# Altium schematic sheet Top Level.SchDoc
size A3; SheetNumber: 1; SheetTotal: 9
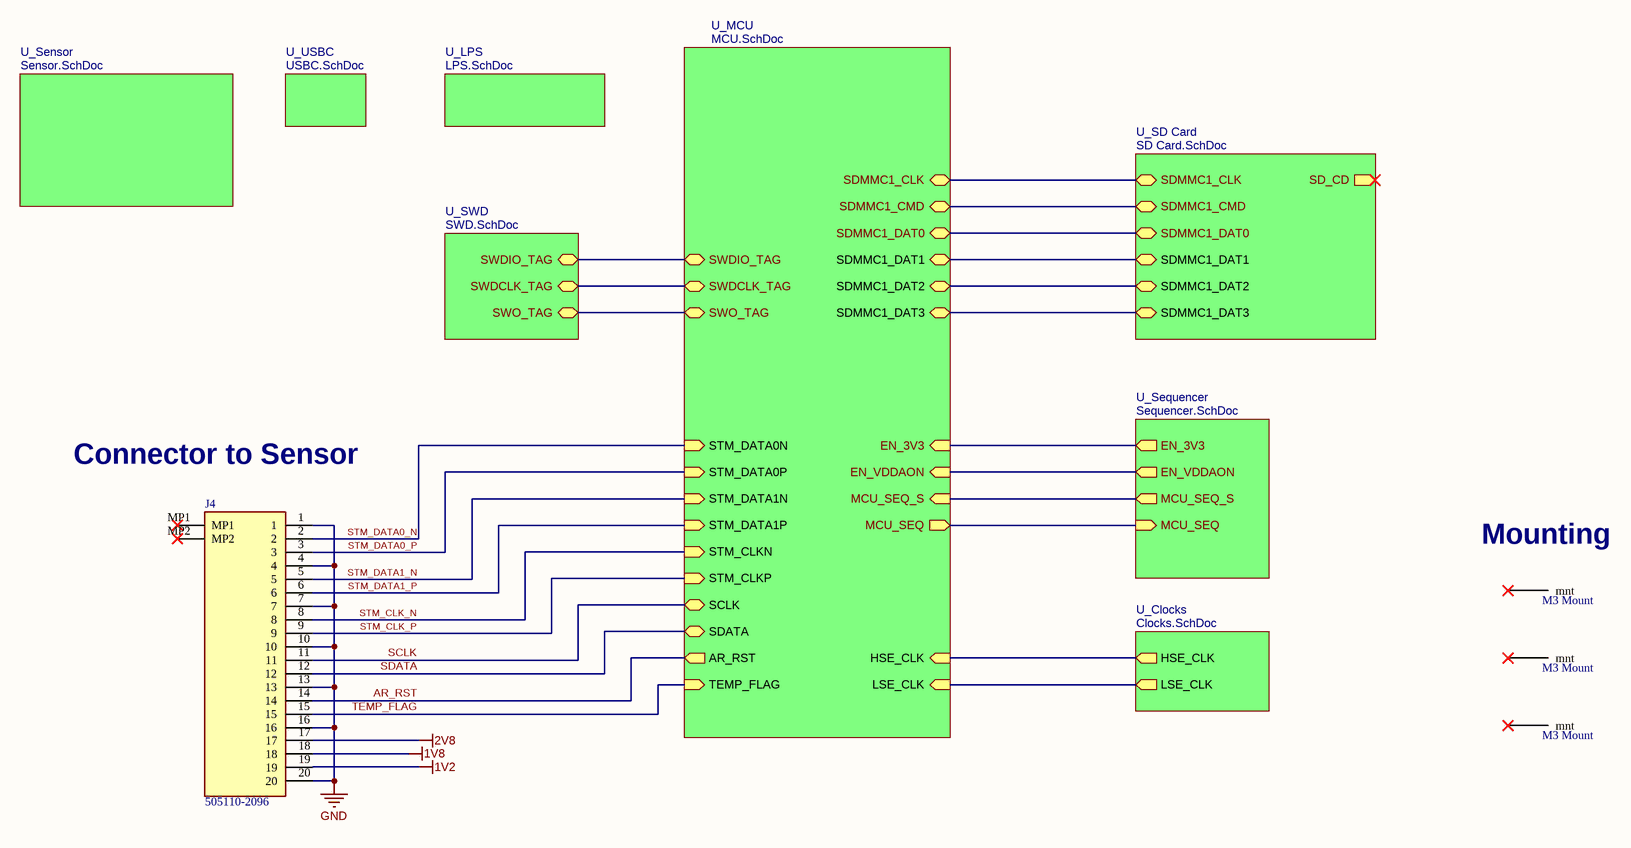
[diagram p0: Top Level.SchDoc]

## Parts
J4  505110-2096  [5051102096]
MNT1  M3 Mount  [M3_Mount-Footprint-1]
MNT2  M3 Mount  [M3_Mount-Footprint-1]
MNT3  M3 Mount  [M3_Mount-Footprint-1]

## Sub-sheets
U_Clocks = Clocks.SchDoc: HSE_CLK (out), LSE_CLK (out)
U_LPS = LPS.SchDoc: no entries
U_MCU = MCU.SchDoc: SWDCLK_TAG (bidir), SWO_TAG (bidir), SWDIO_TAG (bidir), MCU_SEQ (out), MCU_SEQ_S (in), EN_3V3 (in), EN_VDDAON (in), SDMMC1_DAT0 (bidir), SDMMC1_CLK (bidir), SDMMC1_CMD (bidir), SDMMC1_DAT1 (bidir), SDMMC1_DAT2 (bidir), SDMMC1_DAT3 (bidir), HSE_CLK (in), LSE_CLK (in), STM_CLKN (in), STM_CLKP (in), STM_DATA0P (in), STM_DATA0N (in), STM_DATA1P (in), STM_DATA1N (in), SDATA (bidir), SCLK (bidir), AR_RST (out), TEMP_FLAG (in)
U_SD Card = SD Card.SchDoc: SDMMC1_DAT0 (bidir), SDMMC1_CLK (bidir), SDMMC1_CMD (bidir), SD_CD (out), SDMMC1_DAT1 (bidir), SDMMC1_DAT2 (bidir), SDMMC1_DAT3 (bidir)
U_Sensor = Sensor.SchDoc: no entries
U_Sequencer = Sequencer.SchDoc: MCU_SEQ (in), EN_3V3 (out), EN_VDDAON (out), MCU_SEQ_S (out)
U_SWD = SWD.SchDoc: SWDIO_TAG (bidir), SWDCLK_TAG (bidir), SWO_TAG (bidir)
U_USBC = USBC.SchDoc: no entries

## Nets
1V2: J4.19
1V8: J4.18
2V8: J4.17
GND: J4.1 J4.4 J4.7 J4.10 J4.13 J4.16 J4.20
AR_RST: J4.14 ; sheet U_MCU/AR_RST
SCLK: J4.11 ; sheet U_MCU/SCLK
SDATA: J4.12 ; sheet U_MCU/SDATA
STM_CLK_N: J4.8 ; sheet U_MCU/STM_CLKN
STM_CLK_P: J4.9 ; sheet U_MCU/STM_CLKP
STM_DATA0_N: J4.2 ; sheet U_MCU/STM_DATA0N
STM_DATA0_P: J4.3 ; sheet U_MCU/STM_DATA0P
STM_DATA1_N: J4.5 ; sheet U_MCU/STM_DATA1N
STM_DATA1_P: J4.6 ; sheet U_MCU/STM_DATA1P
TEMP_FLAG: J4.15 ; sheet U_MCU/TEMP_FLAG
(unnamed): sheet U_Sequencer/MCU_SEQ, sheet U_MCU/MCU_SEQ
(unnamed): sheet U_Sequencer/EN_3V3, sheet U_MCU/EN_3V3
(unnamed): sheet U_Sequencer/EN_VDDAON, sheet U_MCU/EN_VDDAON
(unnamed): sheet U_Sequencer/MCU_SEQ_S, sheet U_MCU/MCU_SEQ_S
(unnamed): sheet U_MCU/SWDCLK_TAG, sheet U_SWD/SWDCLK_TAG
(unnamed): sheet U_MCU/SWO_TAG, sheet U_SWD/SWO_TAG
(unnamed): sheet U_MCU/SWDIO_TAG, sheet U_SWD/SWDIO_TAG
(unnamed): sheet U_MCU/SDMMC1_DAT0, sheet U_SD Card/SDMMC1_DAT0
(unnamed): sheet U_MCU/SDMMC1_CLK, sheet U_SD Card/SDMMC1_CLK
(unnamed): sheet U_MCU/SDMMC1_CMD, sheet U_SD Card/SDMMC1_CMD
(unnamed): sheet U_MCU/SDMMC1_DAT1, sheet U_SD Card/SDMMC1_DAT1
(unnamed): sheet U_MCU/SDMMC1_DAT2, sheet U_SD Card/SDMMC1_DAT2
(unnamed): sheet U_MCU/SDMMC1_DAT3, sheet U_SD Card/SDMMC1_DAT3
(unnamed): sheet U_MCU/HSE_CLK, sheet U_Clocks/HSE_CLK
(unnamed): sheet U_MCU/LSE_CLK, sheet U_Clocks/LSE_CLK

Not connected (* = marked no-connect by the designer): J4 MP1* MP2*; MNT1 1(mnt)*; MNT2 1(mnt)*; MNT3 1(mnt)*

## Notes on the sheet
- (near J4) Connector to Sensor
- (near MNT1) Mounting

## Library data of the parts
J4 = 505110-2096: Connector; Manufacturer_Name: Molex; Datasheet Link: https://componentsearchengine.com/Datasheets/1/505110-2096.pdf; Height: 2.1mm; Manufacturer_Part_Number: 505110-2096; Mouser Part Number: 538-505110-2096; Mouser Price/Stock: https://www.mouser.co.uk/ProductDetail/Molex/505110-2096?qs=IvjI65BR3TVK2gHWyfgM0A%3D%3D
MNT1-MNT3 = CMP-002-00124-2: M3 mounting hole; Author: Raphael Ho